# Altium schematic sheet Iron_Driver.SchDoc
size A4; SheetNumber: 3; SheetTotal: 5
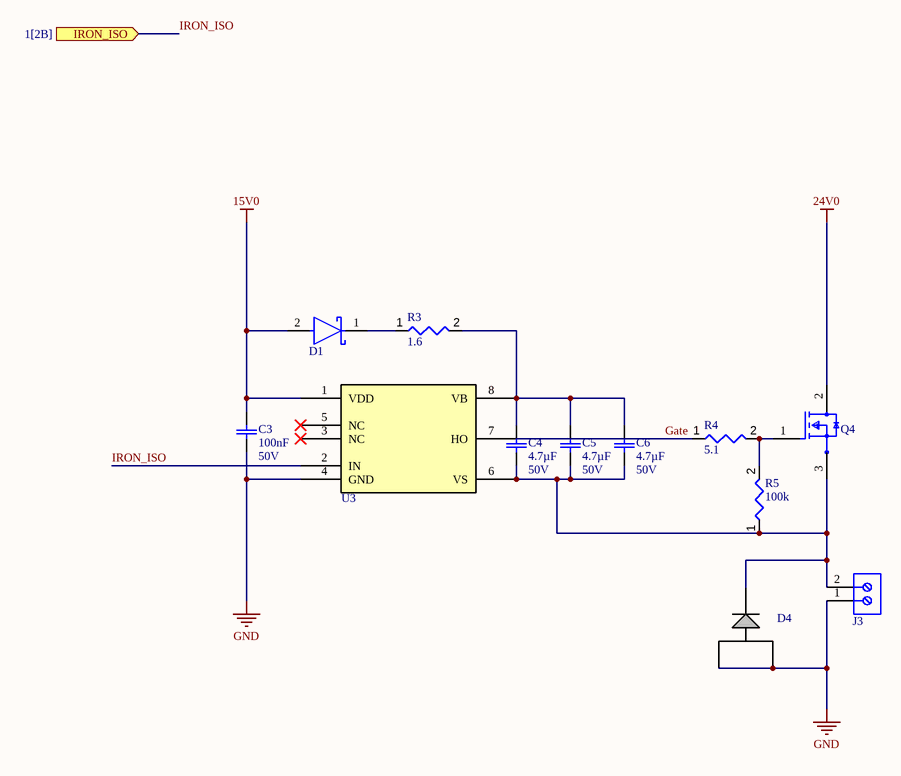
[diagram p0: Iron_Driver.SchDoc]

## Parts
C3  value 100nF  Voltage Rating: 50V  [Generic Ceramic 0603 CAP]  (hidden comment: CAP-MLCC_SMD-0603_MR-GCM_u_0.1uF_50V_10%_X8L)
C4  value 4.7µF  Voltage Rating: 50V  [Generic Ceramic 0805 CAP]  (hidden comment: CAP-MLCC_SMD-0805_TDK-CGA_u_4.7uF_V_10%_X8R)
C5  value 4.7µF  Voltage Rating: 50V  [Generic Ceramic 0805 CAP]  (hidden comment: CAP-MLCC_SMD-0805_TDK-CGA_u_4.7uF_V_10%_X8R)
C6  value 4.7µF  Voltage Rating: 50V  [Generic Ceramic 0805 CAP]  (hidden comment: CAP-MLCC_SMD-0805_TDK-CGA_u_4.7uF_V_10%_X8R)
D1  MBRA340T3G  [ONSC-SMA-2-403D-02_F_V]  (value not drawn)
D4  STPS1045B  [STPS1045B-Footprint-1]  (value not drawn)
J3  691137710002  [691137710002]  (value not drawn)
Q4  STD7NM50N  [STD7NM50N-Footprint-1]  (value not drawn)
R3  value 1.6  [Generic_1206_RES]  (hidden comment: RES-TK_SMD-1206_VIS-CRCW_R_1.6R_3/4W_1%)
R4  value 5.1  [Generic_0805_RES]  (hidden comment: RES-TK_SMD-0805_VIS-CRCW_R_5.1R_1/10W_1%)
R5  value 100k  [Generic_0805_RES]  (hidden comment: RES-TK_SMD-0805_VIS-CRCW_K_100K_1/8W_1%)
U3  fan73711  [fan73711-Footprint-1]  (value not drawn)

## Ports
IRON_ISO (in, see 1[2B])

## Nets
15V0: C3.2 D1.2(A) U3.1(VDD)
24V0: Q4.2
GND: C3.1 D4.1 D4.2 J3.1 U3.4(GND)
Gate: R4.1 U3.7(HO)
IRON_ISO: U3.2(IN) ; port IRON_ISO
NetC4_1: C4.1 C5.1 C6.1 D4.3 J3.2 Q4.3 R5.1 U3.6(VS)
NetC4_2: C4.2 C5.2 C6.2 R3.2 U3.8(VB)
NetD1_1: D1.1(C) R3.1
NetQ4_1: Q4.1 R4.2 R5.2

Not connected (* = marked no-connect by the designer): U3 3(NC)* 5(NC)*

## Library data of the parts
C3 = CMP-001-00115-11: Ceramic Capacitor, Multilayer, Ceramic, 50V, 10% +Tol, 10% -Tol, X8L, -40/+15% TC, 0.1uF, Surface Mount, 0603; Automotive: AEQ-200; Min Operating Temperature: -55°C; Case/Package: 0603; Mounting Technology: Surface Mount; RoHS Compliant: Yes; Capacitor Type: Ceramic; Pins: 2; Max Operating Temperature: 150°C
C4-C6 = CMP-001-00158-2: Ceramic Capacitor, Multilayer, Ceramic, 50V, 10% +Tol, 10% -Tol, X5R, 15% TC, 4.7uF, Surface Mount, 0805; Tolerance: 10%; Max Operating Temperature: 85°C; Case/Package: 0805; RoHS Compliant: Yes; Automotive: AEQ-Q200; Mounting Technology: Surface Mount; Capacitor Type: Ceramic; Pins: 2; Dielectric: x5r; Min Operating Temperature: -55°C
D1 = CMP-001-0146-1: Diode, Schottky Barrier, Vr 40V, If 3A, Pkg SMA, Vf 0.45V, Tj +150degc, Cs 100A, Ir 15mA; Manufacturer Lifecycle Status: ACTIVE; Max Junction Temperature (Tj): 150°C; Number of Elements: 1; Forward Voltage: 450mV; Polarity: Standard; Peak Reverse Current: 300µA; Element Configuration: Single; REACH SVHC: No; Number of Terminals: 2; Width: 2.6mm; Min Operating Temperature: -55°C; Voltage Rating (DC): 40V; Reverse Standoff Voltage: 40V; Max Repetitive Reverse Voltage (Vrrm): 40V; Lifecycle Status: Production; Reverse Voltage: 40V; Output Current: 3A; Pins: 2; Lead Free: Lead Free; Max Reverse Voltage (DC): 40V; Max Forward Surge Current (Ifsm): 100A; Forward Current: 3A; Current Rating: 3A; Length: 4.32mm; Average Rectified Current: 3A; Radiation Hardening: No; Packaging: Tape and Reel; Max Operating Temperature: 150°C; Halogen Free: Halogen Free; China RoHS: Non-Compliant; Case/Package: SMA; RoHS: Compliant; Height: 2.2mm; Schedule B: 8541100080; Max Output current: 3A; Peak Non-Repetitive Surge Current: 100A
D4 = CMP-001-0199-1: Rectifier Diode, Schottky, 1 Phase, 1 Element, 10A, 45V V(RRM), Silicon, TO-252AA; Max Reverse Leakage Current: 100µA; Forward Voltage: 570mV; Polarity: Standard; Max Surge Current: 75A; Element Configuration: Common Anode; Number of Elements: 1; Max Junction Temperature (Tj): 175°C; Current Rating: 10A; Radiation Hardening: No; REACH SVHC: No; Min Operating Temperature: -65°C; Lifecycle Status: Production; China RoHS: Non-Compliant; Schedule B: 8541100080, 8541100080; Forward Current: 10A; Max Reverse Voltage (DC): 45V; Voltage Rating (DC): 45V; Output Current: 10A; Pins: 2; Number of Terminals: 2; Max Operating Temperature: 175°C; Max Output current: 10A; Mounting Technology: Surface Mount; Case/Package: DPAK; Max Repetitive Reverse Voltage (Vrrm): 45V; Average Rectified Current: 10A; Width: 6.2mm; Peak Reverse Current: 100µA; Length: 6.6mm; Lead Free: Lead Free; Peak Non-Repetitive Surge Current: 75A; Reverse Standoff Voltage: 45V; Height: 2.4mm; Max Forward Surge Current (Ifsm): 75A; RoHS: Compliant
J3 = CMP-001-0029-2: 2P Block Terminal; RoHS Compliant: Yes
Q4 = CMP-001-0178-1: N-channel 500V - 0.70 Ohm - 5A - TO-220 - TO-220FP - Ipak - Dpak; Gate to Source Voltage (Vgs): 25V; Max Power Dissipation: 45W; Turn-Off Delay Time: 40ns; Rise Time: 5ns; Drain to Source Resistance: 780mΩ; Element Configuration: Single; Number of Elements: 1; Input Capacitance: 400pF; Nominal Vgs: 3V; Value: 780mΩ; Fall Time: 9ns; Pins: 3; Min Operating Temperature: -55°C; Mounting Technology: Surface Mount; Max Operating Temperature: 150°C; Packaging: Cut Tape (CT); Drain to Source Breakdown Voltage: 500V; Drain to Source Voltage (Vdss): 500V; Min Breakdown Voltage: 500V; Lead Free: Lead Free; China RoHS: Non-Compliant; Rds On Max: 780mΩ; RoHS: Compliant; Lifecycle Status: Obsolete; Case/Package: TO-252-3; Power Dissipation: 45W; Continuous Drain Current (ID): 5A; Number of Terminals: 2; REACH SVHC: No
R3 = CMP-009-00251-1: Fixed Resistor, Metal Glaze/thick Film, 0.75W, 1.6ohm, 200V, 1% +/-Tol, 100ppm/Cel, Surface Mount, 1206; Power: 750mW; Pins: 2; Max Operating Temperature: 155°C; Mounting Technology: Surface Mount; Tolerance: 1%; Min Operating Temperature: -55°C; RoHS Compliant: Yes; Case/Package: 1206
R4 = CMP-009-00244-4: Fixed Resistor, Metal Glaze/thick Film, 0.125W, 1ohm, 150V, 1% +/-Tol, 100ppm/Cel, Surface Mount, 0805; Voltage Rating: 75V; Power: 125mW; Pins: 2; Case/Package: 0805; Tolerance: 1%; Min Operating Temperature: -55°C; RoHS Compliant: Yes; Mounting Technology: Surface Mount; Max Operating Temperature: 155°C
R5 = CMP-009-00208-8: Fixed Resistor, Metal Glaze/thick Film, 0.125W, 100000ohm, 150V, 1% +/-Tol, 100ppm/Cel, Surface Mount, 0805; Power: 125mW; RoHS Compliant: Yes; Case/Package: 0805; Max Operating Temperature: 155°C; Mounting Technology: Surface Mount; Tolerance: 1%; Pins: 2; Min Operating Temperature: -55°C; Voltage Rating: 150V
U3 = CMP-001-0175-1: Tape & Reel (TR) FAN73711 High-Side 2009 gate driver 25ns 125C 4A 4A 625mW; Manufacturer Lifecycle Status: ACTIVE; Output Voltage: 1.2V; Number of Outputs: 1; Max Supply Current: 100µA; Turn-Off Delay Time: 150ns; Min Supply Voltage: 10V; Max Supply Voltage: 20V; Operating Supply Voltage: 15V; Nominal Supply Current: 35µA; Fall Time: 15ns; Max Junction Temperature (Tj): 150°C; Max Output current: 4A; Max Operating Temperature: 125°C; Power Dissipation: 625mW; REACH SVHC: Yes; Terminal Pitch: 1.27mm; Rise Time: 25ns; Length: 4.92mm; Radiation Hardening: No; Width: 3.95mm; Weight: 143mg; Turn-On Delay Time: 150ns; Packaging: Cut Tape; Max Power Dissipation: 625mW; Pins: 8; Number of Circuits: 1; Lifecycle Status: Production; Schedule B: 8542310000, 8542310000; Mounting Technology: Surface Mount; China RoHS: Compliant; RoHS: Compliant; Output Current: 4A; Lead Free: Lead Free; Number of Drivers: 1; Min Operating Temperature: -40°C; Propagation Delay: 150ns; Height - Seated (Max): 1.8mm; Number of Channels: 1; Height: 1.85mm; Ambient Temperature Range High: 125°C; Case/Package: SOP; Number of Terminals: 8